# EAGLE design rgb_and_irdistance_side (EAGLE 6.5.0)
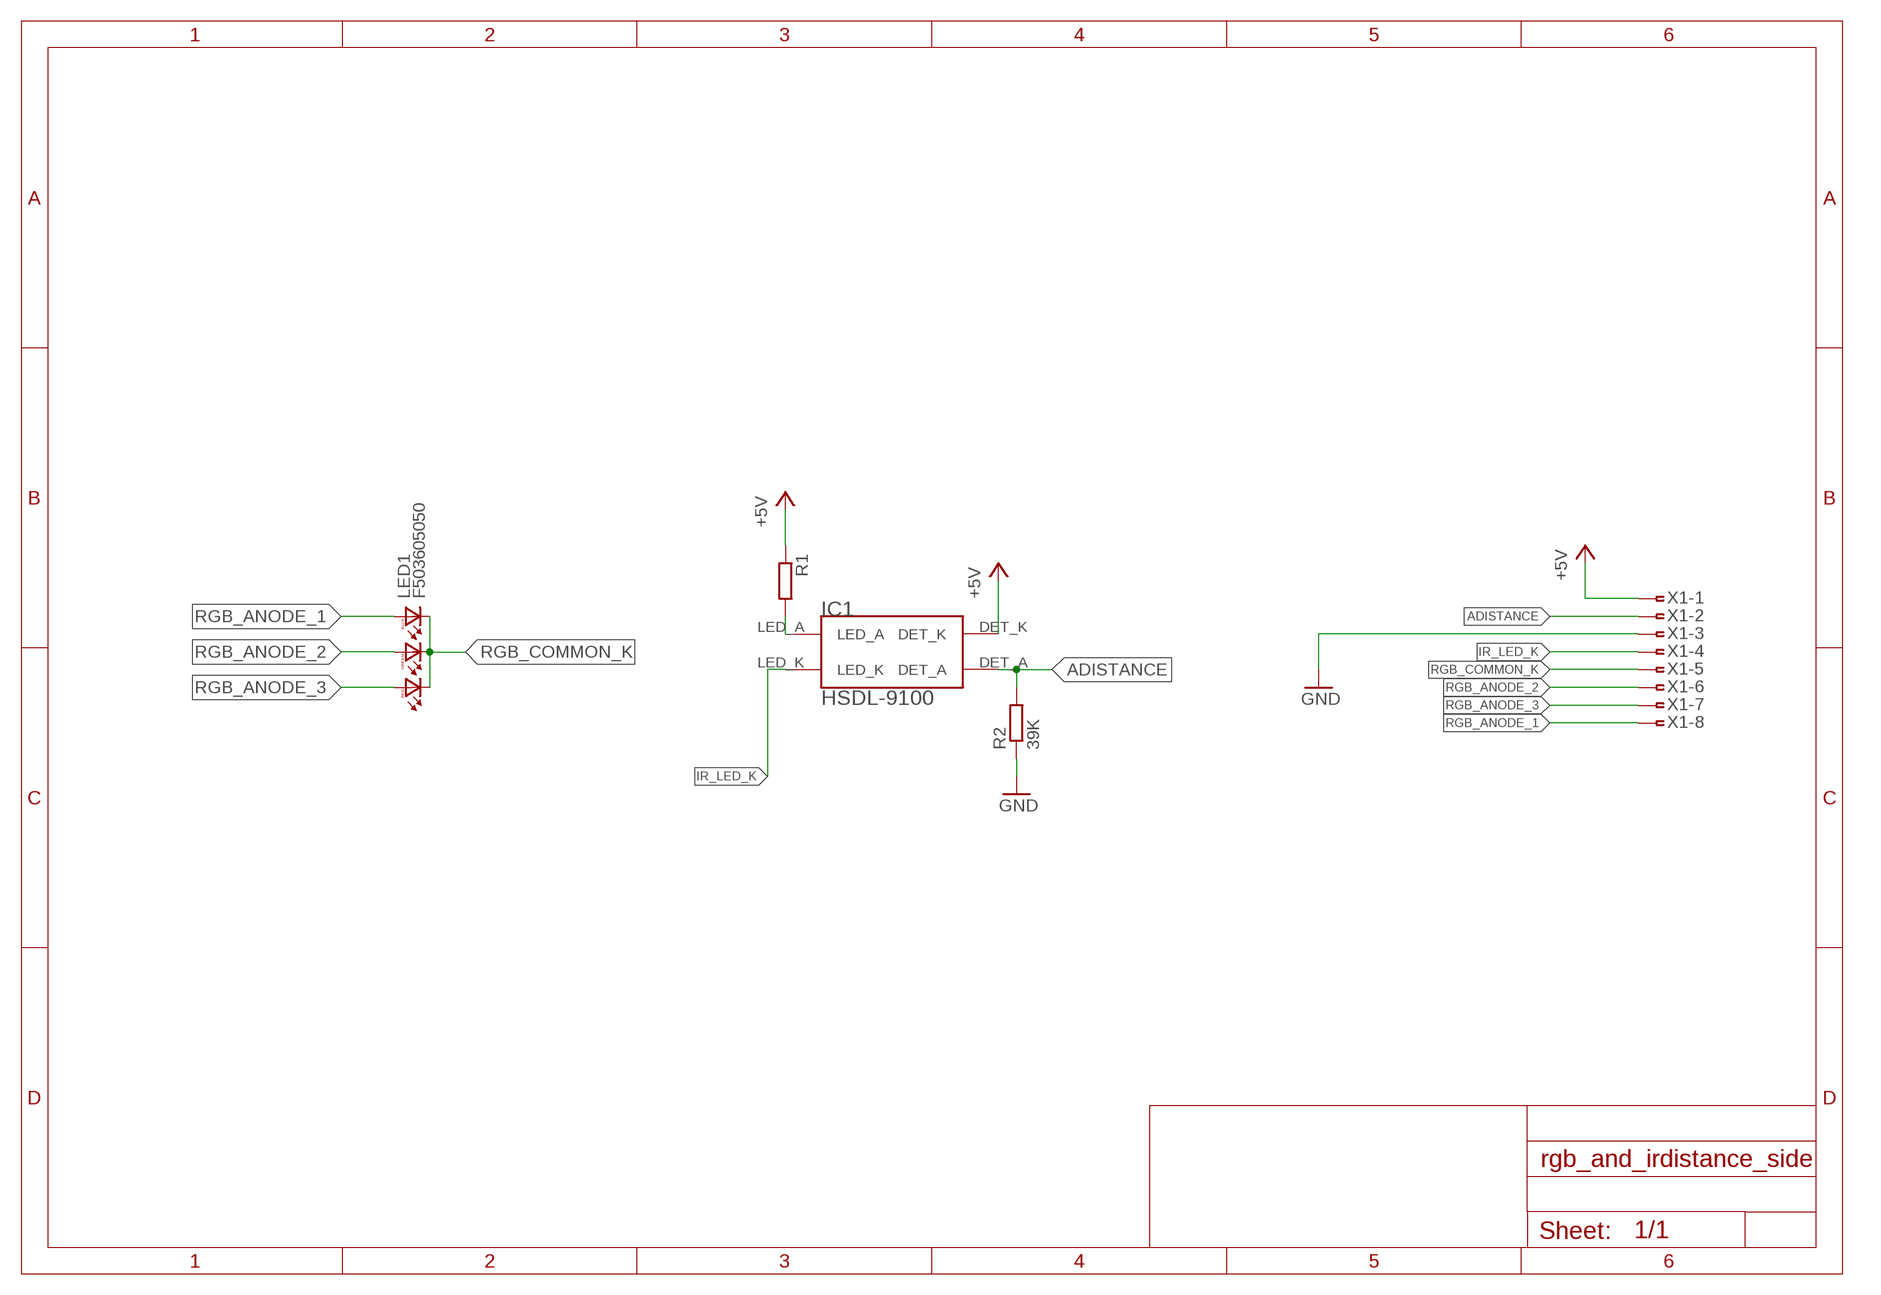
[diagram p0: schematic, sheet 1]

## Parts
IC1  HSDL-9100  [HSDL-9100]
LED1  F503605050  [5050LED]
R1  R-EU_M0805  [M0805]
R2  39K  R-EU_M0805  [M0805]
X1  FTOP-8  [FTOP-8]

## Nets
+5V: IC1.DET_K R1.1 X1.1
ADISTANCE: IC1.DET_A R2.2 X1.2
GND: R2.1 X1.3
IR_LED_K: IC1.LED_K X1.4
N$2: IC1.LED_A R1.2
RGB_ANODE_1: LED1.B1(BA) X1.8
RGB_ANODE_2: LED1.G1(GA) X1.6
RGB_ANODE_3: LED1.R1(RA) X1.7
RGB_COMMON_K: LED1.B2(BC) LED1.G2(GC) LED1.R2(RC) X1.5

## Library data of the parts
IC1 = BEEP:HSDL-9100
LED1 = BEEP:F50360: Full color Z-Power LED RGB P5-II Series Source: http://www.seoulsemicon.co.kr .. F50360.pdf
R1 R2 = resistor:R-EU_: RESISTOR, European symbol
X1 = con-amp:FTOP-8: AMP connector

## Board
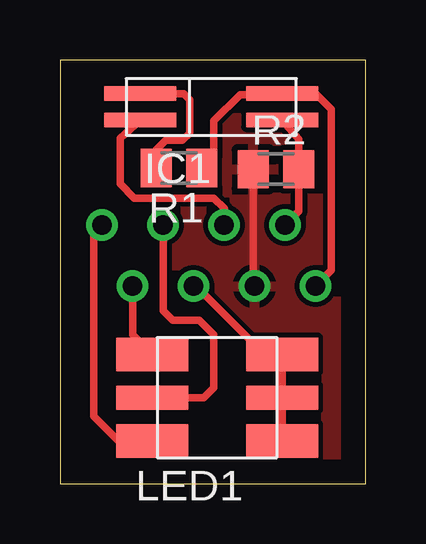
[diagram p1: board, top side]
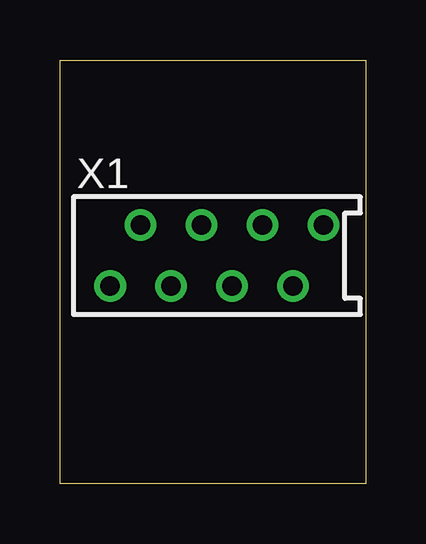
[diagram p2: board, bottom side, seen from below]

Size 12.73 x 17.65 mm. Coordinates in mm from the lower left corner, seen from the top.
Outline: 0,0 12.73,0 12.73,17.65 0,17.65 0,0
Copper layers (1*16): Top 0.035mm / dielectric 1.5mm / Bottom 0.035mm
Design rules "default": minimum track width 10mil, minimum drill 24mil, track to track 8mil, track to pad 8mil, pad to pad 8mil, via to via 8mil, smd to smd 8mil, copper to edge 40mil, drill to drill 8mil, minimum pad ring 10mil, minimum via ring 8mil, stop-mask expansion 4mil, vias tented up to drill 0mil, thermal gap 10mil

### Footprints (pad centres in the part's own frame; a part is rotated, then mirrored left to right if it is on the bottom)
HSDL-9100 = smd 3 x 0.6: DET_A 2.95,-0.55; DET_K 2.95,0.55; LED_A -2.95,0.55; LED_K -2.95,-0.55
5050LED = smd 3 x 1.4: B1 -2.7,-1.8; B2 2.7,-1.8; R1 -2.7,1.8; R2 2.7,1.8 | smd 3 x 1: G1 -2.7,0; G2 2.7,0
M0805 = smd 1.3 x 1.6: 1 -0.95,0; 2 0.95,0
FTOP-8 = drill 0.813: 1 -4.445,-1.27; 2 -3.175,1.27; 3 -1.905,-1.27; 4 -0.635,1.27; 5 0.635,-1.27; 6 1.905,1.27; 7 3.175,-1.27; 8 4.445,1.27

### Placement (x,y rotation side)
IC1  6.3,15.7 0 top
LED1  6.55,3.58 0 top
R1  4.96,13.15 180 top
R2  9,13.1 0 top
X1  6.2,9.5 0 bottom

### Tracks (layer width: path | path; a pad name or v marks a point on that pad's centre or on a via)
+5V
  Top 0.305: X1.1 11.3,8.89 11.3,15.6 10.65,16.25 IC1.DET_K 9.1,16.2 7.5,16.2 6.41,15.11 6.41,13.65 R1.1
ADISTANCE
  Top 0.305: IC1.DET_A 9.95,14.35 R2.2 9.95,11.35 X1.2
GND
  Top 0.305: R2.1 8.05,8.29 X1.3
  pour Top: 0,0 12.79,0 12.79,17.66 0,17.66
IR_LED_K
  Top 0.305: X1.4 6.83,11.46 6.4,11.9 3.1,11.9 2.5,12.5 2.5,14.4 IC1.LED_K
N$2
  Top 0.305: IC1.LED_A 5.15,16.25 5.4,16 5.4,14.6 5.1,14.3 4.4,14.3 4.01,13.91 R1.2
RGB_ANODE_1
  Top 0.305: X1.8 1.75,10.76 1.4,10.4 1.4,2.8 2.4,1.8 3.83,1.8 LED1.B1
RGB_ANODE_2
  Top 0.305: X1.6 4.3,7.2 4.7,6.8 5.8,6.8 6.4,6.2 6.4,4 5.98,3.58 LED1.G1
RGB_ANODE_3
  Top 0.305: X1.7 3.02,6.21 LED1.R1
RGB_COMMON_K
  Top 0.305: X1.5 5.67,8.23 8.5,5.4 9.23,5.4 LED1.R2 LED1.G2 LED1.B2